# EAGLE board D21_v38 (EAGLE 7.3.0)
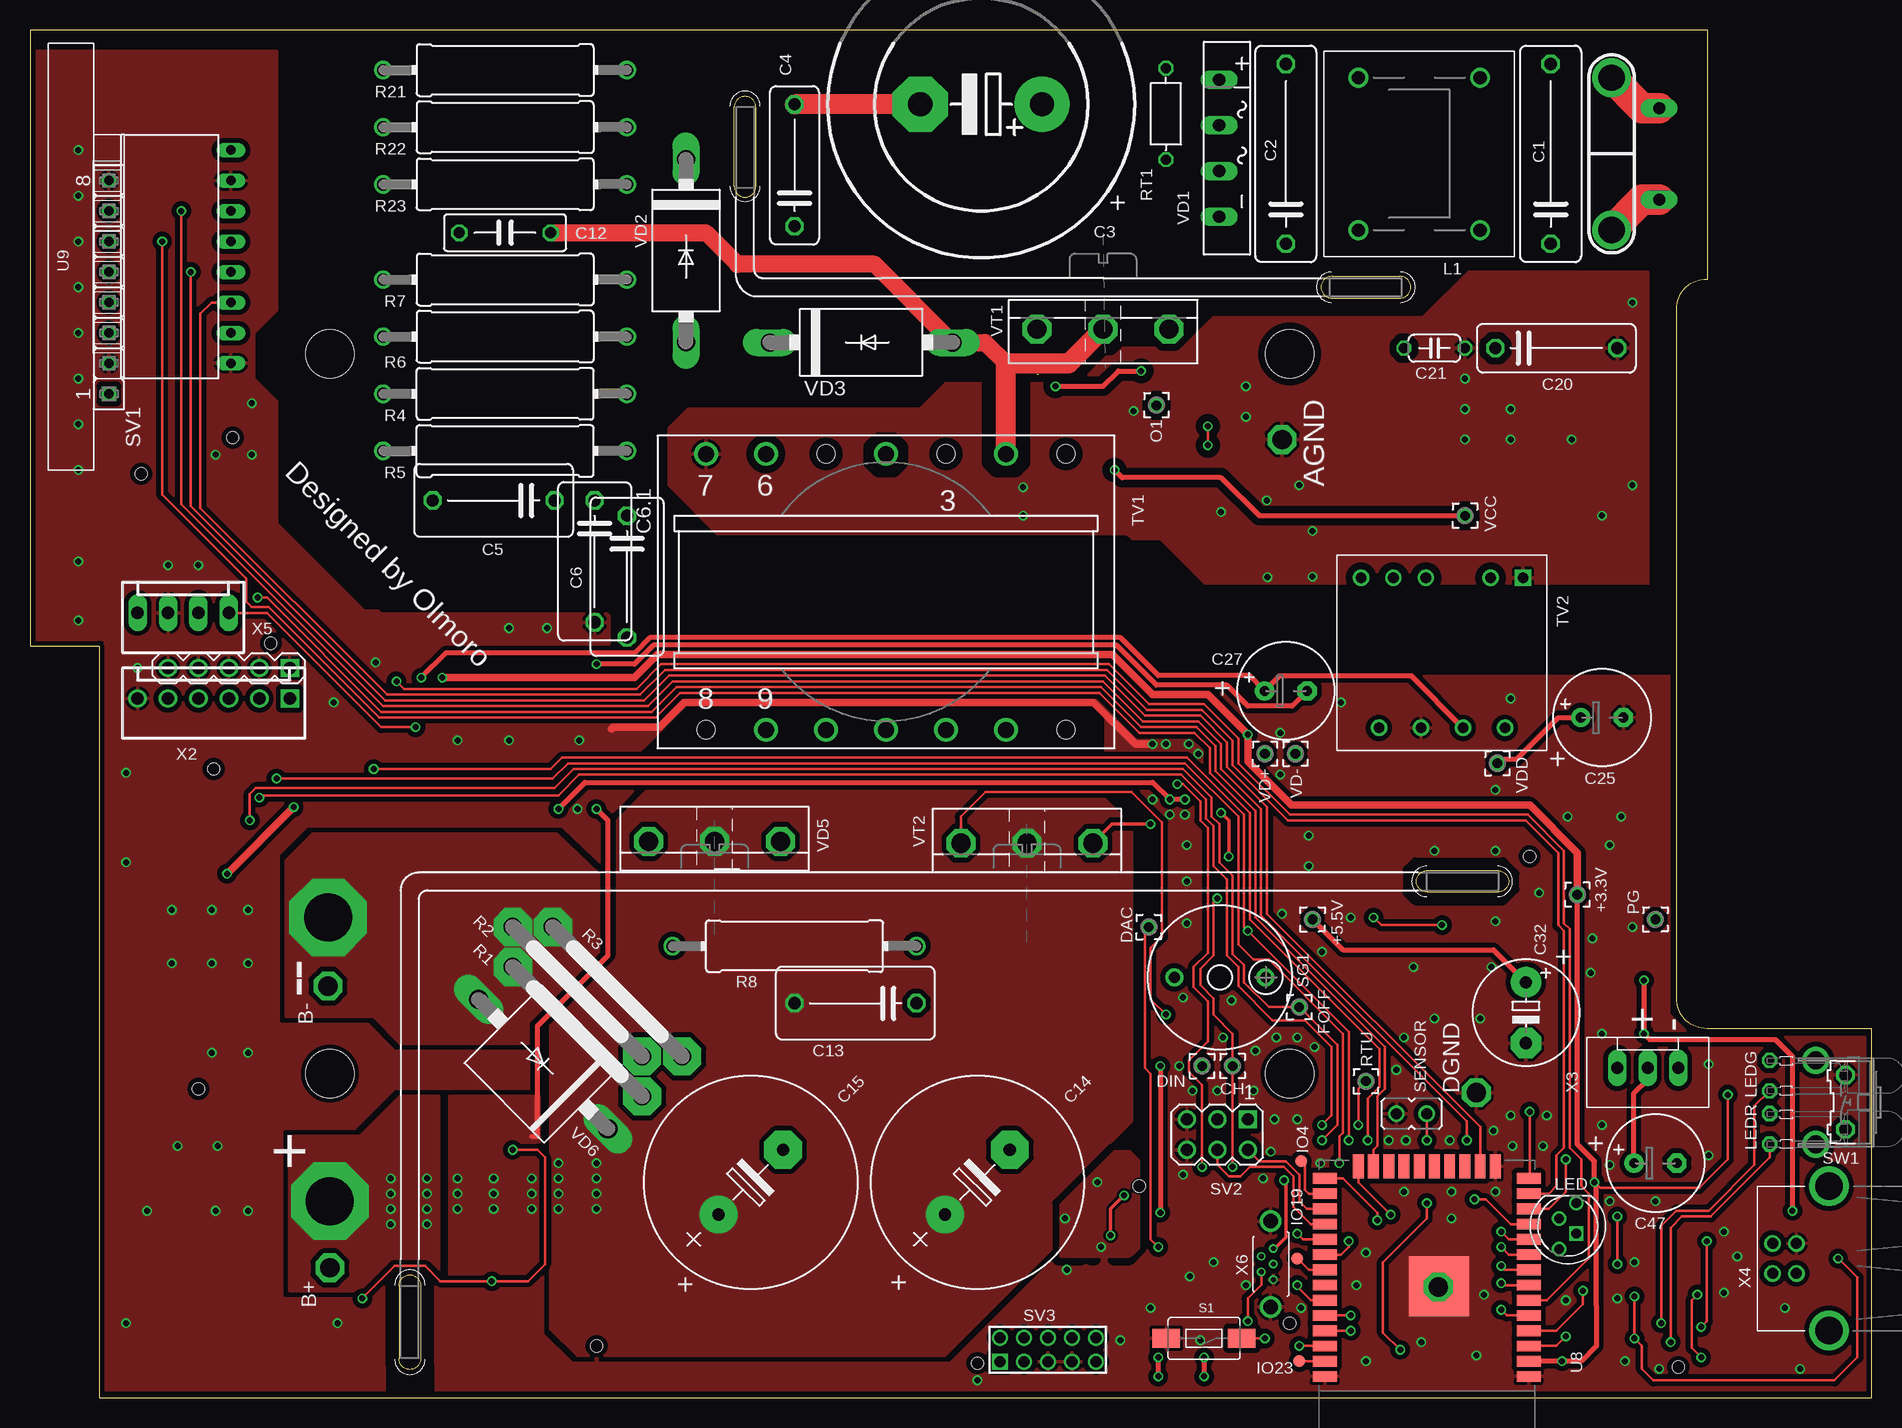
[diagram p4: board, top side]
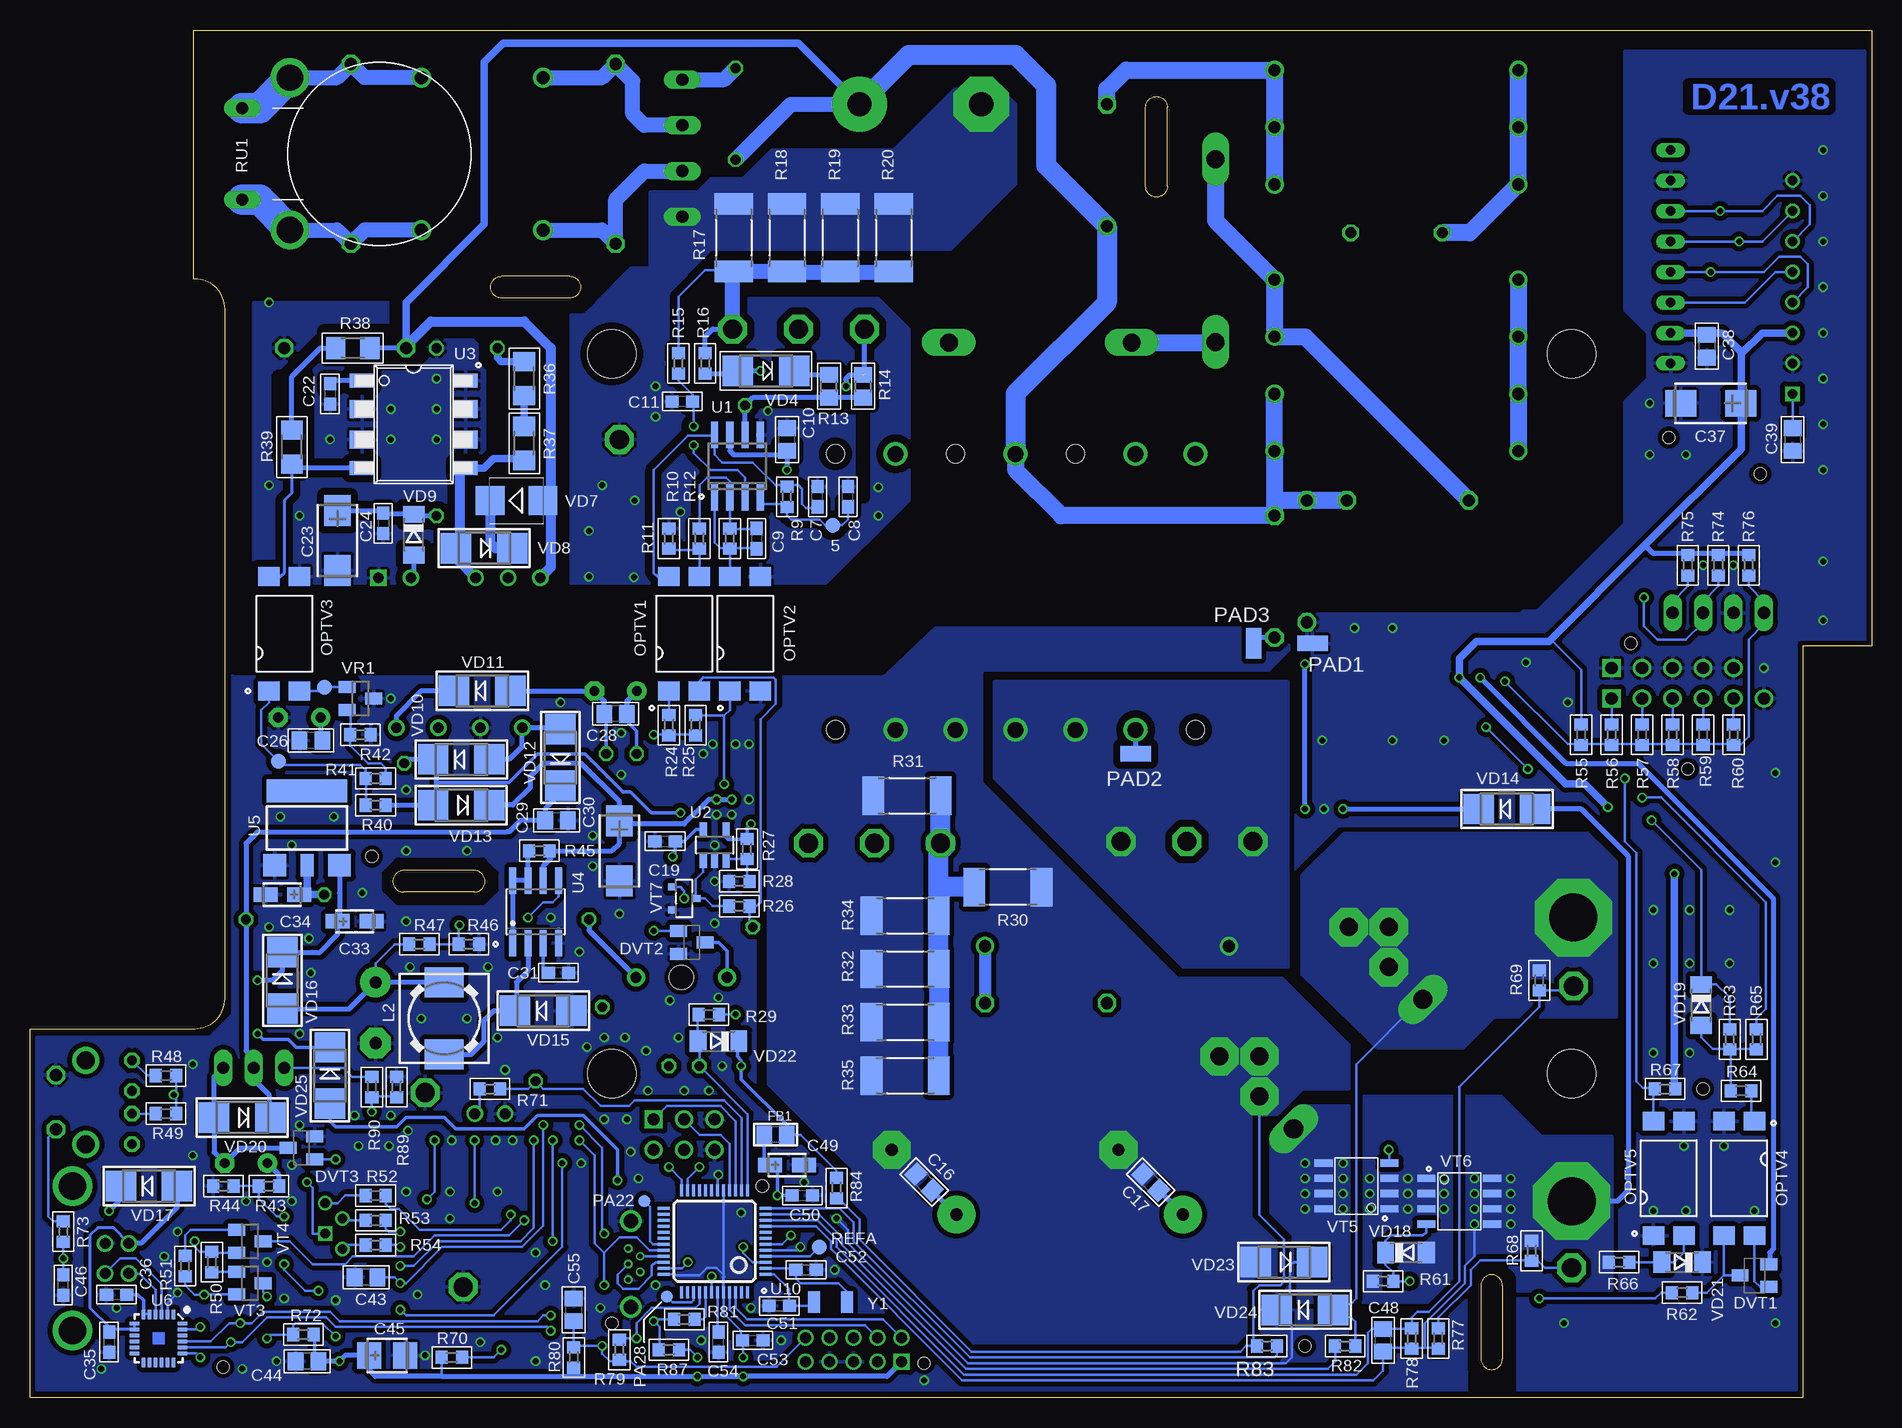
[diagram p5: board, bottom side, seen from below]

Size 153.5 x 114 mm. Coordinates in mm from the lower left corner, seen from the top.
Outline: 5.75,0 153.5,0 153.5,30.75 139.75,30.75 arc-90 137.25,33.25 137.25,90.75 arc-90 139.75,93.25 139.85,93.25 139.85,114 0,114 0,62.66 5.75,62.66 5.75,0
Copper layers (1*16): Top 0.018mm / dielectric 1.5mm / Bottom 0.018mm
Design rules "4-layers_00_2016 *": minimum track width 0.2mm, minimum drill 0.4mm, track to track 0.2mm, track to pad 0.2mm, pad to pad 0.2mm, via to via 0.2mm, smd to smd 0.2mm, copper to edge 0.2mm, drill to drill 0.4mm, minimum pad ring 0.15mm, minimum via ring 0.15mm, stop-mask expansion 4mil, vias tented up to drill 0mil, thermal gap 10mil
Holes 4 mm at 105,27 25,27 25,87 105,87
Holes 2 mm at 99.21,35.01
Holes 1 mm at 105,6.2 92.46,17.63 125.01,45.09 137.39,2.55 78.97,2.87 47.22,4.3 14.04,25.73 15.31,52.4 20.07,62.87 9.28,77 16.9,80.02
tRestrict: 82 lines
bRestrict: 89 lines
vRestrict: area 102,24 to 108,30; area 102,84 to 108,90; area 22,24 to 28,30; area 22,84 to 28,90

## Footprints (pad centres in the part's own frame; a part is rotated, then mirrored left to right if it is on the bottom)
B1,27 = smd 1.27 x 1.27: TP 0,0
MA05-1 = drill 1.016 square: 1 -5.08,0 | drill 1.016: 2 -2.54,0; 3 0,0; 4 2.54,0; 5 5.08,0
WIREPAD8_3 = drill 4 pad 6.452 octagon: P$1 0,0
1,6/0,8 = drill 0.8 octagon: 1 0,0
4,16O1,6 = drill 1.6 octagon: 1 0,0
C150-054X183 = drill 1.016 octagon: 1 -7.493,0; 2 7.493,0
EB25D = drill 2.007 pad 4.597: + -5.08,0 | drill 2.007 pad 4.597 octagon: - 5.08,0
C102-043X133 = drill 1.016 octagon: 1 -5.08,0; 2 5.08,0
C102-064X133 = drill 1.016 octagon: 1 -5.08,0; 2 5.08,0
C0603 = smd 1.1 x 1: 1 -0.85,0; 2 0.85,0
C0805 = smd 1.3 x 1.5: 1 -0.95,0; 2 0.95,0
C075-032X103 = drill 0.914 octagon: 1 -3.81,0; 2 3.81,0
E7,5-18 = drill 1.016 pad 3.15: + -3.81,0 | drill 1.016 pad 3.15 octagon: - 3.81,0
C050-024X044 = drill 0.813 octagon: 1 -2.54,0; 2 2.54,0
CT6032 = smd 2.6 x 2.2: + 2.5,0; - -2.5,0
E3,5-8 = drill 0.813 pad 1.6: + -1.778,0 | drill 0.813 pad 1.6 octagon: - 1.778,0
E5-8,5 = drill 1.016 pad 2.54: + -2.54,0 | drill 1.016 pad 2.54 octagon: - 2.54,0
CT3216 = smd 2 x 1.2: + 1.4,0; - -1.4,0
CT3528 = smd 2 x 2.2: + 1.5,0; - -1.5,0
SC59-BEC = smd 1 x 1.4: B -0.95,-1.2; C 0,1.2; E 0.95,-1.2
SOT23-BEC = smd 1 x 1.4: B -0.95,-1.1; C 0,1.1; E 0.95,-1.1
0805 = smd 1.3 x 1.5: 1 -0.95,0; 2 0.95,0
TESTPOINT_ROUND_1MM = smd 1 x 1: P$1 0,0
DK30 = drill 1.1: 1 -6.35,-5.08; 2 -6.35,5.08; 3 6.35,-5.08; 4 6.35,5.08
DR74 = smd 2.5 x 3.25: 1 -3,0; 2 3,0
LED5MMRGB = drill 0.8: P$1 -1.905,0.714; P$2 -0.635,-0.714; P$4 1.905,-0.714 | drill 0.8 square: P$3 0.635,0.714
LED3MM-H7MMG = drill 0.813 pad 1.27 octagon: A 0,-1.27; K 0,1.27
LED3MM-H7MMR = drill 0.813 pad 1.27 octagon: A 0,-1.27; K 0,1.27
SMD4-7 = smd 1.78 x 1.55: 1 -1.27,-4.77; 2 1.27,-4.77; 3 1.27,4.77; 4 -1.27,4.77
SMD1,27-2,54 = smd 1.27 x 2.54: 1 0,0
15S-1.3 = drill 1.5 pad 3.2 octagon: 1 -7.62,0; 2 7.62,0
0515/20 = drill 1.016: 1 -10.16,0; 2 10.16,0
R0603 = smd 1 x 1.1: 1 -0.85,0; 2 0.85,0
R0805 = smd 1.3 x 1.5: 1 -0.95,0; 2 0.95,0
R2512 = smd 1.8 x 3.2: 1 -2.8,0; 2 2.8,0
R1206 = smd 1.6 x 1.803: 1 -1.422,0; 2 1.422,0
NTC15 = drill 0.813 octagon: 1 -3.81,0; 2 3.81,0
S10K11-H = drill 1.016 long: 1 0,-3.81; 2 0,3.81
TACTILE-SWITCH-1101NE = smd 2.3 x 1.6: P$1 -3.15,0; P$2 3.15,0
JP1 = drill 0.914: 1 0,-1.27; 2 0,1.27
BMT1205XH7.5 = drill 0.9 pad 1.5: + 3.8,0; - -3.8,0
FE08 = drill 0.813 square: 1 -8.89,0 | drill 0.813: 2 -6.35,0; 3 -3.81,0; 4 -1.27,0; 5 1.27,0; 6 3.81,0; 7 6.35,0; 8 8.89,0
MA03-2 = drill 1.016 square: 1 -2.54,-1.27 | drill 1.016: 2 -2.54,1.27; 3 0,-1.27; 4 0,1.27; 5 2.54,-1.27; 6 2.54,1.27
MA5-2-2MM = drill 0.9 pad 1.27 square: 1 -4,-1 | drill 0.9 pad 1.27: 2 -4,1; 3 -2,-1; 4 -2,1; 5 0,-1; 6 0,1; 7 2,-1; 8 2,1; 9 4,-1; 10 4,1
B3F-31XX = drill 1.016 octagon: 1 -2.261,-1.245; 2 2.261,-1.245 | drill 1.499 pad 2.159: 3 -3.505,1.245; 4 3.505,1.245
BS25022 = drill 1.321: 2 -10,-11.5; 4 0,-11.5; 6 10,-11.5; 7 15,-11.5; 9 10,11.5; 10 5,11.5; 11 0,11.5; 12 -5,11.5; 13 -10,11.5 | hole 1.5: -15,-11.5; -5,-11.5; 5,-11.5; 15,11.5; -15,11.5
BS9001 = drill 0.9 square: 1 -6.25,6.75 | drill 0.9: 2 -6.25,4.05; 4 -6.25,-1.35; 5 -6.25,-4.05; 6 -6.25,-6.75; 7 6.25,-5.25; 8 6.25,-1.75; 9 6.25,1.75; 10 6.25,5.25
SO08 = smd 0.6 x 2.2: 1 -1.905,-2.6; 2 -0.635,-2.6; 3 0.635,-2.6; 4 1.905,-2.6; 5 1.905,2.6; 6 0.635,2.6; 7 -0.635,2.6; 8 -1.905,2.6
SOT23-5 = smd 0.6 x 1.2: 1 -0.95,-1.306; 2 0,-1.306; 3 0.95,-1.306; 4 0.95,1.306; 5 -0.95,1.306
SMD-8 = smd 1.168 x 2.032: 1 -3.632,-4.318; 4 3.632,-4.318; 5 3.632,4.318; 8 -3.632,4.318 | smd 1.524 x 2.032: 2 -1.27,-4.318; 3 1.27,-4.318; 6 1.27,4.318; 7 -1.27,4.318
SOT223-W = smd 1.9 x 1.9: 1 -2.7,-3.1; 3 2.7,-3.1 | smd 1.1 x 1.9: 2 0,-3.1 | smd 6.7 x 1.9: 4 0,3.1
QFN-24 = smd 0.8 x 0.3: 1 -2,1.25; 2 -2,0.75; 3 -2,0.25; 4 -2,-0.25; 5 -2,-0.75; 6 -2,-1.25; 13 2,-1.25; 14 2,-0.75; 15 2,-0.25; 16 2,0.25; 17 2,0.75; 18 2,1.25 | smd 0.3 x 0.8: 7 -1.25,-2; 8 -0.75,-2; 9 -0.25,-2; 10 0.25,-2; 11 0.75,-2; 12 1.25,-2; 19 1.25,2; 20 0.75,2; 21 0.25,2; 22 -0.25,2; 23 -0.75,2; 24 -1.25,2
ESP-WROOM-32MORO = smd 2 x 0.9: 1 -8.5,8.255; 2 -8.5,6.985; 3 -8.5,5.715; 4 -8.5,4.445; 5 -8.5,3.175; 6 -8.5,1.905; 7 -8.5,0.635; 8 -8.5,-0.635; 9 -8.5,-1.905; 10 -8.5,-3.175; 11 -8.5,-4.445; 12 -8.5,-5.715; 13 -8.5,-6.985; 14 -8.5,-8.255; 25 8.5,-8.255; 26 8.5,-6.985; 27 8.5,-5.715; 28 8.5,-4.445; 29 8.5,-3.175; 30 8.5,-1.905; 31 8.5,-0.635; 32 8.5,0.635; 33 8.5,1.905; 34 8.5,3.175; 35 8.5,4.445; 36 8.5,5.715; 37 8.5,6.985; 38 8.5,8.255 | smd 0.9 x 2: 15 -5.715,-9.255; 16 -4.445,-9.255; 17 -3.175,-9.255; 18 -1.905,-9.255; 19 -0.635,-9.255; 20 0.635,-9.255; 21 1.905,-9.255; 22 3.175,-9.255; 23 4.445,-9.255; 24 5.715,-9.255 | smd 5 x 5: 39 -1,0.75
TFT_1_8 = drill 0.813 long: 1 -8.89,-11.43; 2 -6.35,-11.43; 3 -3.81,-11.43; 4 -1.27,-11.43; 5 1.27,-11.43; 6 3.81,-11.43; 7 6.35,-11.43; 8 8.89,-11.43
LQFP48_W = smd 0.27 x 1: 1 -2.75,-4.25; 2 -2.25,-4.25; 3 -1.75,-4.25; 4 -1.25,-4.25; 5 -0.75,-4.25; 6 -0.25,-4.25; 7 0.25,-4.25; 8 0.75,-4.25; 9 1.25,-4.25; 10 1.75,-4.25; 11 2.25,-4.25; 12 2.75,-4.25; 25 2.75,4.25; 26 2.25,4.25; 27 1.75,4.25; 28 1.25,4.25; 29 0.75,4.25; 30 0.25,4.25; 31 -0.25,4.25; 32 -0.75,4.25; 33 -1.25,4.25; 34 -1.75,4.25; 35 -2.25,4.25; 36 -2.75,4.25 | smd 1 x 0.27: 13 4.25,-2.75; 14 4.25,-2.25; 15 4.25,-1.75; 16 4.25,-1.25; 17 4.25,-0.75; 18 4.25,-0.25; 19 4.25,0.25; 20 4.25,0.75; 21 4.25,1.25; 22 4.25,1.75; 23 4.25,2.25; 24 4.25,2.75; 37 -4.25,2.75; 38 -4.25,2.25; 39 -4.25,1.75; 40 -4.25,1.25; 41 -4.25,0.75; 42 -4.25,0.25; 43 -4.25,-0.25; 44 -4.25,-0.75; 45 -4.25,-1.25; 46 -4.25,-1.75; 47 -4.25,-2.25; 48 -4.25,-2.75
2KBP = drill 1.016 long: + 5.715,0; - -5.715,0; AC1 -1.905,0; AC2 1.905,0
DO201-15 = drill 1.499 long: A 7.62,0; C -7.62,0
SMADIODE = smd 2.54 x 2.54: A 2.349,0; C -2.349,0
TO-247AD-V = drill 1.6 octagon: D 0,-2.54; G -5.5,-2.54; S 5.5,-2.54
P6-15 = drill 1.6 long: A 7.62,0; C -7.62,0
SMB = smd 2.4 x 2.4: A 2.2,0; C -2.2,0
SOD80C = smd 1.4 x 1.8: A 1.7,0; C -1.7,0
SOT23 = smd 1 x 1.4: 1 -0.95,-1.1; 2 0.95,-1.1; 3 0,1.1
SO-8 = smd 1.524 x 0.61: 1 -2.743,1.905; 2 -2.743,0.635; 3 -2.743,-0.635; 4 -2.743,-1.905; 5 2.743,-1.905; 6 2.743,-0.635; 7 2.743,0.635; 8 2.743,1.905
SOT23-R = smd 0.6 x 0.7: 1 -0.95,-1; 2 0.95,-1; 3 0,1
220VAC = drill 2.2: P$1 -6.35,0; P$2 6.35,0
WF-6 = drill 1.016 square: 1 0,-6.35 | drill 1.016: 2 0,-3.81; 3 0,-1.27; 4 0,1.27; 5 0,3.81; 6 0,6.35
WF-3 = drill 1.016 long: 1 0,-2.54; 2 0,0; 3 0,2.54
USB-B-H = drill 0.914: D+ 0,1.25; D- 1.981,1.25; GND 0,-1.25; VBUS 1.981,-1.25 | drill 2.286: P$1 -2.718,-6.02; P$2 -2.718,6.02
WF-4 = drill 1.016 long: 1 0,-3.81; 2 0,-1.27; 3 0,1.27; 4 0,3.81
USB_MICRO_180 = drill 0.4 pad 0.7: 1 -1.302,0.218; 2 -0.652,-0.782; 3 -0.002,0.218; 4 0.648,-0.782; 5 1.298,0.218 | drill 1.2: 6 -3.577,-0.002; 7 3.573,-0.002
SMD03215C2 = smd 1 x 1.8: P$1 -1.5,0; P$2 1.25,0

## Placement (x,y rotation side)
5  TPB1,27  [B1,27]  86.59,72.72 0 bottom
(X2)  [MA05-1]  16.58,60.81 180 top
+  +  [WIREPAD8_3]  24.99,16.36 0 top
+3.3V  [1,6/0,8]  128.98,41.92 0 top
+5.5V  [1,6/0,8]  106.91,39.86 180 top
-  -  [WIREPAD8_3]  24.84,40.01 0 top
AGND  [4,16O1,6]  104.37,79.86 270 top
B+  [4,16O1,6]  24.99,10.8 90 top
B-  [4,16O1,6]  24.84,34.3 270 top
C1  473K 275V  [C150-054X183]  126.75,103.67 90 top
C2  473K 275V  [C150-054X183]  104.69,103.67 90 top
C3  220mkF 400V  [EB25D]  79.29,107.8 180 top
C4  10nF 2KV  [C102-043X133]  63.73,102.72 90 top
C5  4.7nF ± 10% 2KV  [C102-064X133]  38.65,74.78 180 top
C6  JEC JY222M  [C102-064X133]  49.76,68.43 270 top
C6.1  JEC JY222M  [C102-064X133]  47.06,69.7 270 top
C7  100nF X7R  [C0603]  87.86,75.1 90 bottom
C8  1nF NP0  [C0603]  85.32,75.1 90 bottom
C9  100nF X7R  [C0603]  92.94,71.61 270 bottom
C10  100nF X7R  [C0805]  90.4,79.86 90 bottom
C11  470pF X7R  [C0603]  99.13,83.03 180 bottom
C12  0.15nF 2kV  [C075-032X103]  39.6,97.09 180 top
C13  4.7nF 1KV  [C102-064X133]  68.81,32.87 180 top
C14  4700mkF 35V  [E7,5-18]  78.97,17.95 45 top
C15  4700mkF 35V  [E7,5-18]  60.08,17.95 45 top
C16  1mkF X7R 50V  [C0805]  78.97,17.95 135 bottom
C17  1mkF X7R 50V  [C0805]  60.08,17.95 135 bottom
C19  100nF X7R  [C0603]  100.56,46.36 0 bottom
C20  10nF 2KV  [C102-043X133]  127.23,87.48 0 top
C21  68pF 2KV (82pF)  [C050-024X044]  117.07,87.48 0 top
C22  100nF X7R  [C0603]  128.5,83.67 270 bottom
C23  TAJB106K025RNJ  [CT6032]  127.87,71.45 90 bottom
C24  100nF X7R  [C0603]  124.06,72.88 270 bottom
C25  220uF 35v  [E3,5-8]  131.04,56.68 0 top
C26  470nF X7R  [C0805]  130.09,54.78 180 bottom
C27  220uF 35v  [E3,5-8]  104.69,58.91 0 top
C28  100nF X7R  [C0805]  104.69,57 180 bottom
C29  1mkF X7R  [C0805]  109.61,48.11 0 bottom
C30  T491A106K035AT  [CT6032]  104.37,45.57 90 bottom
C31  470pF X7R  [C0603]  109.45,35.41 0 bottom
C32  470uF 16v  [E5-8,5]  124.69,32.08 270 top
C33  T491A106K010AT  [CT3216]  126.44,39.7 180 bottom
C34  T491A106K010AT  [CT3216]  132.47,41.92 0 bottom
C35  100nF X7R  [C0603]  146.92,4.61 270 bottom
C36  100nF X7R  [C0603]  146.28,8.58 180 bottom
C37  TAJB336K010RNJ  [CT6032]  13.41,82.88 0 bottom
C38  470nF X7R  [C0805]  13.72,87.64 270 bottom
C39  470nF X7R  [C0805]  6.58,79.86 270 bottom
C43  470nF X7R  [C0805]  125.48,10.01 180 bottom
C44  1mkF X7R  [C0805]  130.41,3.02 180 bottom
C45  TAJC107K006RNJ  [CT3528]  123.74,3.5 180 bottom
C46  3.3uF X7R  [C0603]  150.72,9.38 90 bottom
C47  470mkF 25v  [E3,5-8]  135.49,19.53 0 top
C48  470nF X7R  [C0805]  40.71,4.77 90 bottom
C49  T491A106K010AT  [CT3216]  90.4,19.38 180 bottom
C50  100nF X7R  [C0603]  89.13,16.84 0 bottom
C51  15pF X7R  [C0603]  91.03,7.63 180 bottom
C52  15pF X7R  [C0603]  88.81,10.65 0 bottom
C53  100nF X7R  [C0603]  93.26,4.77 0 bottom
C54  100nF X7R  [C0603]  96.11,4.61 90 bottom
C55  100nF X7R  [C0805]  108.18,7.31 270 bottom
CH  [1,6/0,8]  100.24,27.63 0 top
DAC  [1,6/0,8]  93.26,39.22 90 top
DGND  [4,16O1,6]  120.56,25.41 270 top
DGND1  [4,16O1,6]  117.39,9.22 0 top
DIN  [1,6/0,8]  97.7,27.63 180 top
DVT1  PDTA123ET  [SC59-BEC]  9.76,10.17 90 bottom
DVT2  PDTD123ET  [SOT23-BEC]  98.34,37.95 270 bottom
DVT3  PDTD123ET  [SOT23-BEC]  130.88,20.8 90 bottom
FB1  BLM21AG221SN1D  [0805]  91.35,21.92 180 bottom
FOFF  [1,6/0,8]  105.8,32.55 90 top
HS1  HS92X40-2  [YS92X40]  31.66,43.03 180 top
HS2  HS55X15-1  [HS55X15]  59.6,92.56 0 top
IO4  [TESTPOINT_ROUND_1MM]  105.96,19.69 90 top
IO19  [TESTPOINT_ROUND_1MM]  105.64,11.6 90 top
IO23  [TESTPOINT_ROUND_1MM]  105.8,3.02 90 top
L1  PLA10AN1522R0R2  [DK30]  115.8,103.67 90 top
L2  SD74R-221  [DR74]  118.97,31.6 270 bottom
LED  5mm RGB LED common anode  [LED5MMRGB]  128.18,14.3 270 top
LEDG  LED3MM-GREEN  [LED3MM-H7MMG]  145.01,26.84 180 top
LEDR  LED3MM-RED  [LED3MM-H7MMR]  145.01,22.39 180 top
O1  [1,6/0,8]  93.89,82.72 0 top
OPTV1  K10104C  [SMD4-7]  98.97,63.67 0 bottom
OPTV2  K10104C  [SMD4-7]  93.89,63.67 0 bottom
OPTV3  K10104C  [SMD4-7]  132.31,63.67 0 bottom
OPTV4  K10104C  [SMD4-7]  11.02,18.27 180 bottom
OPTV5  K10104C  [SMD4-7]  16.9,18.27 0 bottom
PA22  [TESTPOINT_ROUND_1MM]  102.31,16.36 0 bottom
PA28  [TESTPOINT_ROUND_1MM]  100.4,8.42 0 bottom
PAD1  [SMD1,27-2,54]  46.59,62.87 90 bottom
PAD2  [SMD1,27-2,54]  61.35,53.67 270 bottom
PAD3  [SMD1,27-2,54]  51.51,62.87 0 bottom
PG  [1,6/0,8]  135.49,39.86 90 top
R1  15S-1.3  [15S-1.3]  45.63,30.49 135 top
R2  15S-1.3  [15S-1.3]  45.63,33.82 135 top
R3  15S-1.3  [15S-1.3]  48.97,33.82 135 top
R4  12k ± 5%  [0515/20]  39.6,83.67 0 top
R5  12k ± 5%  [0515/20]  39.6,78.91 0 top
R6  12k ± 5%  [0515/20]  39.6,88.43 180 top
R7  12k ± 5%  [0515/20]  39.6,93.19 180 top
R8  39 Om ± 5%  [0515/20]  63.73,37.63 0 top
R9  9k1 1%  [R0603]  90.4,75.1 270 bottom
R10  10k  [R0603]  97.7,71.61 90 bottom
R11  2k2  [R0603]  100.24,71.61 270 bottom
R12  10k  [R0603]  95.16,71.61 90 bottom
R13  1R0  [R0805]  86.91,84.31 90 bottom
R14  5R1  [R0805]  84.05,84.31 90 bottom
R15  1k  [R0603]  99.45,86.21 90 bottom
R16  10k  [R0603]  97.23,86.21 270 bottom
R17  1R0 1%  [R2512]  94.84,96.69 270 bottom
R18  1R0 1%  [R2512]  90.4,96.69 270 bottom
R19  1R0 1%  [R2512]  85.95,96.69 270 bottom
R20  1R0 1%  [R2512]  81.51,96.69 270 bottom
R21  1.2k ± 5%  [0515/20]  39.6,110.66 180 top
R22  1.2k ± 5%  [0515/20]  39.6,105.9 180 top
R23  1.2k ± 5%  [0515/20]  39.6,101.13 180 top
R24  470  [R0603]  100.24,56.05 270 bottom
R25  470  [R0603]  98.02,56.05 270 bottom
R26  5k1  [R0603]  94.37,40.97 0 bottom
R27  [R0603]  93.73,45.73 270 bottom
R28  [R0603]  94.37,43.03 180 bottom
R29  [R0603]  96.91,31.92 180 bottom
R30  1R0 1%  [R2512]  71.98,42.55 180 bottom
R31  1R0 1%  [R2512]  80.4,50.17 0 bottom
R32  1R0 1%  [R2512]  80.56,35.73 0 bottom
R33  1R0 1%  [R2512]  80.56,31.28 0 bottom
R34  1R0 1%  [R2512]  80.56,40.17 0 bottom
R35  1R0 1%  [R2512]  80.56,26.84 0 bottom
R36  k75  [R1206]  112.31,84.94 270 bottom
R37  k75  [R1206]  112.31,79.54 270 bottom
R38  1MOm  [R1206]  126.59,87.48 180 bottom
R39  1MOm  [R1206]  131.68,79.22 270 bottom
R40  100  [R0603]  124.69,49.38 180 bottom
R41  10k0 1%  [R0603]  124.69,51.6 0 bottom
R42  1k5 1%  [R0603]  125.96,55.25 0 bottom
R43  5k1 1%  [R0603]  133.58,17.63 180 bottom
R44  1k 1%  [R0603]  137.39,17.63 0 bottom
R45  0R33  [R0603]  111.04,45.57 180 bottom
R46  3.0k 1%  [R0603]  116.91,37.79 180 bottom
R47  10k 1%  [R0603]  121.04,37.79 180 bottom
R48  1K  [R0603]  142.15,26.84 0 bottom
R49  1K  [R0603]  142.15,23.66 0 bottom
R50  12K  [R0603]  138.34,11.28 90 bottom
R51  12K  [R0603]  140.56,10.96 270 bottom
R52  150R  [R0603]  124.69,16.84 180 bottom
R53  330R  [R0603]  124.69,14.77 180 bottom
R54  470R  [R0603]  124.69,12.71 180 bottom
R55  1.5k 1%  [R0603]  24.2,55.25 90 bottom
R56  k750 1%  [R0603]  21.66,55.25 90 bottom
R57  k300 1%  [R0603]  19.12,55.25 270 bottom
R58  1k5 1%  [R0603]  16.58,55.25 270 bottom
R59  3k0 1%  [R0603]  14.04,55.25 270 bottom
R60  7k5 1%  [R0603]  11.5,55.25 90 bottom
R61  2.2k  [R0603]  40.71,9.69 180 bottom
R62  330  [R0603]  15.79,8.74 0 bottom
R63  nu  [R0603]  11.82,29.85 270 bottom
R64  330  [R0603]  10.87,25.57 0 bottom
R65  330  [R0603]  9.6,29.85 270 bottom
R66  2.2k  [R0603]  21.03,11.28 0 bottom
R67  68k  [R0603]  17.22,25.73 180 bottom
R68  100R  [R0603]  28.33,12.23 90 bottom
R69  100R  [R0603]  27.69,34.77 90 bottom
R70  10k 1%  [R0603]  118.34,3.34 0 bottom
R71  30k  [R0603]  115.16,25.73 0 bottom
R72  12k  [R0603]  130.72,5.25 180 bottom
R73  470  [R0603]  150.72,13.82 90 bottom
R74  4k7  [R0603]  12.77,69.38 270 bottom
R75  4k7  [R0603]  15.31,69.38 270 bottom
R76  4k7  [R0603]  10.23,69.38 270 bottom
R77  39k0 1%  [R0603]  36.11,4.93 90 bottom
R78  7k5 1%  [R0603]  38.33,4.93 90 bottom
R79  470  [R0603]  104.37,3.98 270 bottom
R80  10k  [R0603]  108.18,3.34 270 bottom
R81  470??  [R0603]  98.97,6.52 180 bottom
R82  100  [R0603]  43.89,4.3 0 bottom
R83  100  [R0603]  50.39,4.3 180 bottom
R84  10k  [R0603]  86.27,17.47 90 bottom
R87  470??  [R0603]  100.24,3.98 180 bottom
R89  [R0603]  122.94,25.89 90 bottom
R90  [R0603]  125.01,25.89 270 bottom
REFA  TPB1,27  [B1,27]  87.7,12.55 0 bottom
RT1  NTC10D-15  [NTC15]  94.69,107.01 90 top
RTU  [1,6/0,8]  111.35,26.36 90 top
RU1  V275LA20AP  [S10K11-H]  135.8,103.67 0 bottom
S1  FSMSM  [TACTILE-SWITCH-1101NE]  97.86,4.93 180 top
SENSOR  [JP1]  115.16,23.66 270 top
SG1  BMT1205XH7.5  [BMT1205XH7.5]  99.2,35.03 0 top
SV1  [FE08]  6.58,92.56 90 top
SV2  [MA03-2]  98.97,21.92 180 top
SV3  MA05-2-2MM  [MA5-2-2MM]  84.84,3.98 0 top
SW1  SWT-3  [B3F-31XX]  150.09,24.62 90 top
TP11  TPB1,27  [B1,27]  132.79,53.03 180 bottom
TP12  TPB1,27  [B1,27]  128.98,59.22 180 bottom
TV1  BS25022  [BS25022]  71.35,67.16 180 top
TV2  BS9001  [BS9001]  117.7,62.08 270 top
U0  D20BOX  [D20BOX]  65,57 90 top
U1  UC3845B  [SO08]  94.53,77.64 0 bottom
U2  LM321MF  [SOT23-5]  96.43,46.05 0 bottom
U3  TNY254GN  [SMD-8]  121.52,81.13 270 bottom
U4  MC34063AD  [SO08]  111.35,40.49 0 bottom
U5  LM1117MP-3.3  [SOT223-W]  130.41,47.48 0 bottom
U6  CP2104  [QFN-24]  142.79,4.93 270 bottom
U8  ESP-WROOM-32 MODULE  [ESP-WROOM-32MORO]  116.44,10.01 180 top
U9  WF18FTLAADNN0  [TFT_1_8]  5.31,95.1 90 top
U10  ATSAMD21G1XA-A  [LQFP48_W]  96.43,13.03 90 bottom
VCC  [1,6/0,8]  119.61,73.51 0 top
VD1  KBP206  [2KBP]  99.13,104.15 90 top
VD2  SF58  [DO201-15]  54.68,95.61 270 top
VD3  SF58  [DO201-15]  69.29,87.96 0 top
VD4  US1M  [SMADIODE]  92.15,85.58 180 bottom
VD5  MBR30100PT  [TO-247AD-V]  57.06,43.82 180 top
VD6  FR607  [P6-15]  42.77,27.79 135 top
VD7  P6SMB200A  [SMB]  112.94,74.78 0 bottom
VD8  US1M  [SMADIODE]  115.64,70.81 180 bottom
VD9  LL4148  [SOD80C]  121.52,71.92 270 bottom
VD10  US1M  [SMADIODE]  117.55,53.19 0 bottom
VD11  US1M  [SMADIODE]  115.8,58.91 0 bottom
VD12  US1M  [SMADIODE]  109.29,53.35 90 bottom
VD13  US1M  [SMADIODE]  117.55,49.38 180 bottom
VD14  SS16  [SMADIODE]  30.39,49.06 0 bottom
VD15  SS16  [SMADIODE]  110.72,32.23 0 bottom
VD16  SS16  [SMADIODE]  132.47,34.77 270 bottom
VD17  SS16  [SMADIODE]  143.58,17.63 0 bottom
VD18  BZV55C13  [SOD80C]  38.81,12.07 0 bottom
VD19  LL4148 nu  [SOD80C]  14.2,32.71 270 bottom
VD20  US1M  [SMADIODE]  135.8,23.34 180 bottom
VD21  LL4148  [SOD80C]  15.79,11.28 180 bottom
VD22  LL4148 nu  [SOD80C]  96.11,29.7 180 bottom
VD23  SS16  [SMADIODE]  48.97,11.28 180 bottom
VD24  SS16  [SMADIODE]  47.22,7.31 0 bottom
VD25  SS16  [SMADIODE]  128.5,26.84 270 bottom
VD+  [1,6/0,8]  102.94,53.67 90 top
VD-  [1,6/0,8]  105.48,53.67 90 top
VDD  [1,6/0,8]  122.31,52.87 90 top
VR1  TL431A (TAI 3)  [SOT23]  125.96,58.27 270 bottom
VT1  STW10NK60Z  [TO-247AD-V]  89.45,91.61 0 top
VT2  IRFP250N  [TO-247AD-V]  83.1,43.66 180 top
VT3  BC847C  [SOT23]  135.17,9.53 270 bottom
VT4  BC847C  [SOT23]  135.17,13.03 270 bottom
VT5  IRF8788  [SO-8]  42.93,17.63 180 bottom
VT6  IRF8788  [SO-8]  34.36,16.36 0 bottom
VT7  2N7002  [SOT23-R]  98.97,41.6 270 bottom
X1  220VAC  [220VAC]  131.83,103.67 90 top
X2  WF-6 (PLD-10)  [WF-6]  15.31,58.27 90 top
X3  WF-3 (WF-2)  [WF-3]  134.85,27.47 90 top
X4  USB-B  [USB-B-H]  147.23,11.6 180 top
X5  WF-4  [WF-4]  12.77,65.41 90 top
X6  USB_MICRO_BF_180  [USB_MICRO_180]  103.42,11.12 270 top
Y1  FC-135  [SMD03215C2]  86.91,7.95 180 bottom

## Tracks (layer width: path | path; a pad name or v marks a point on that pad's centre or on a via)
5.5V
  Top 0.4: +5.5V.1 109.45,37.31 121.99,37.31 C32.+
  Bottom 0.2: R47.2 123.1,37.79 124.69,36.2 C32.+
  Bottom 0.4: VD16.A 132.44,32.39 126.91,32.39 C32.+ 124.67,34.6 119.77,34.6 | 119.83,34.66 119.77,34.6 | 119.77,34.6 L2.1
  Bottom 0.406: +5.5V.1 106.91,38.94 SG1.+
10-11
  pour Bottom (isolate 0.61, no thermals): 48.65,35.89 57.38,35.89 73.1,51.6 73.1,59.7 48.65,59.7
+3.3  (via drill 0.5)
  Top 0.2: v130.41,17.95 130.88,17.47 139.14,17.47 141.52,19.85 v141.52,25.25
  Top 0.4: 125.7,3.02 v127.71,3.02 129.29,3.02 130.56,4.3 130.56,7.63 | v130.41,17.95 130.41,19.69 128.98,21.12 +3.3V.1
  Top 0.406: 125.7,3.02 U8.2 | 130.56,7.63 130.56,17.79 v130.41,17.95 | v94.21,27.63 v94.21,15.41 | v94.05,1.76 v94.05,3.34 | v97.86,3.34 v97.86,1.76
  Top 0.61: v34.36,60.02 50.39,60.02 52.3,61.92 90.24,61.92 93.58,58.59 98.18,58.59 v101.51,55.25 101.51,53.03 105.16,49.38 125.01,49.38 128.98,45.41 +3.3V.1 | v21.98,49.22 v16.42,43.66
  Bottom 0.2: R48.2 141.3,25.46 v141.52,25.25 141.3,25.04 R49.2 | LED.P$3 129.93,13.66 129.93,17.47 v130.41,17.95 | R55.2 24.2,60.65 26.74,63.19 | v101.51,55.25 100.19,55.25 | R70.1 119.19,1.81 119.13,1.76 | 95.68,10.21 U10.44 95.68,7.04 94.21,5.56 94.21,4.87 C53.1 94.05,4.72 v94.05,3.34 | U10.36 99.72,10.28 99.61,10.17 97.7,10.17 97.07,10.8 96.27,10.8 95.68,10.21 | U10.17 95.68,16 | 95.68,10.21 95.68,16 | 95.68,16 95.64,16.04 | FB1.1 89.29,21.92 86.27,18.9 R84.2 | R25.2 98.02,55.25 100.19,55.25 | 100.19,55.25 R24.2 | R87.1 98.5,3.98 v97.86,3.34
  Bottom 0.254: U10.44 95.68,10.05 95.64,10.09
  Bottom 0.3: R72.1 129.77,5.25 129.77,3.03 | R75.1 15.31,70.34
  Bottom 0.305: FB1.1 90.4,22.71 94.21,26.52 v94.21,27.63 94.21,28.11 94.53,28.43 94.53,29.58 VD22.C
  Bottom 0.4: C45.+ 127.23,3.5 v127.71,3.02 | 130.43,41.92 130.41,41.95
  Bottom 0.406: R67.1 16.42,25.73 | R76.1 10.23,70.34 12.77,70.34 | 12.77,70.34 15.31,70.34 18.17,70.34 18.88,71.05 | R74.1 12.77,70.34 | v127.71,3.02 C44.1 129.77,3.02 129.77,3.03 | C45.+ 125.24,2.3 124.69,1.76 119.13,1.76 108.18,1.76 | 108.18,1.76 v97.86,1.76 v94.05,1.76 82.07,1.76 SV3.1 | R80.2 108.18,1.76
  Bottom 0.61: v21.98,49.22 23.88,51.13 25.47,51.13 v34.36,60.02 34.36,61.6 32.93,63.03 26.9,63.03 26.74,63.19 18.88,71.05 10.87,79.07 10.87,82.84 C37.+ 10.87,82.92 10.87,87 | U5.2 130.41,41.95 130.41,41.92 +3.3V.1 | C34.+ 130.43,41.92 | U9.2 13.88,88.75 C38.1 13.72,88.75 12.45,88.75 10.87,87.16 10.87,87 | v16.42,43.66 16.42,25.73 | SV1.3 9.12,88.75 10.87,87
  pour Bottom: 93.42,16.04 99.45,16.04 99.45,10.01 93.42,10.01
+300V
  Bottom 0.4: C20.1 R38.1
  Bottom 0.61: C3.+ 89.45,112.88 114.05,112.88 115.64,111.29 115.64,97.8 122.15,91.29 C20.1
  Bottom 0.813: 110.74,74.76 110.72,74.78 | 110.74,74.76 110.77,74.78 VD7.A 110.09,75.44 110.09,87.48 112.31,89.7 120.09,89.7 122.15,87.64 C20.1 | 110.74,74.76 110.11,74.76 110.09,74.78 110.09,69.2 TV2.6
  Bottom 1.27: C3.+ 90.08,107.8 RT1.1
  Bottom 1.422: R4.2 R5.2 C6.1 | TV1.4 71.35,77.32 67.54,73.51 C6.1 | C6.1 49.76,74.78 C6.1.1 C5.1
  Bottom 1.676: TV1.4 71.35,83.67 63.73,91.29 C4.1 68.81,102.72 68.81,109.39 71.35,111.93 80.24,111.93 C3.+
AGND  (via drill 0.5)
  Top 1.676: C3.- C4.2
  Bottom 1.422: R23.1 R22.1 R21.1 62.14,110.66 63.73,109.07 C4.2
  other vias: 106.91,68.43 82.78,75.89 133.58,76.05 133.58,91.29 123.42,82.4 123.42,79.86 119.61,82.4 119.61,79.86 119.61,84.94 131.04,73.51 103.16,68.38 106.91,72.24 82.78,73.51 99.29,73.83 103.1,74.78 91.99,82.24 101.35,81.77 105.8,76.05 128.5,79.86 101.35,84.31
  pour Top (isolate 0.61): 134.85,67.48 134.85,93.83 119.93,93.83 116.12,90.02 98.66,90.02 96.11,87.48 79.29,87.48 74.21,82.4 54.84,82.4 53.25,80.81 53.25,76.05 57.7,71.61 94.21,71.61 98.34,67.48
  pour Bottom (isolate 0.61): 134.85,91.29 106.28,91.29 103.42,94.15 99.29,94.15 96.75,91.61 82.78,91.61 80.24,89.07 80.24,74.78 87.54,67.48 134.85,67.48
  pour Bottom (isolate 0.61, no thermals): 76.75,95.73 96.75,95.73 98.66,93.83 101.83,93.83 101.83,100.5 97.86,100.5 96.75,101.61 94.05,101.61 91.67,103.99 81.51,103.99 76.43,109.07 72.62,109.07 71.35,107.8 71.35,101.13
B
  Bottom 0.2: R57.1 X2.2
B+
  Bottom 0.2: 28.23,11.28 R68.1 | R68.1 28.59,11.38 28.65,11.44 32.62,11.44 33.41,10.65 33.41,9.38 36.11,6.68 R77.2 | B+.1 27.22,10.8 27.8,11.38 R68.1
B-
  Bottom 0.2: B-.1 25.21,33.92 R69.1 27.69,32.55 34.36,25.89 34.36,9.69 36.9,7.15 37.85,7.15 38.33,6.68 R78.2 38.33,5.72 C48.2 41.66,5.72 41.98,5.41 41.98,2.87 42.93,1.91 75.64,1.91 86.27,12.55 86.27,13.19 87.86,14.78 U10.10
BAT+  (via drill 0.5, 0.5 pad 0.5)
  Bottom 0.2: VT6.8 31.66,18.31 | 37.22,4.14 38.33,4.14 R78.1 38.43,4.08 38.49,4.14 40.4,4.14 C48.1 | 37.22,4.14 36.16,4.14 R77.1 | U10.9 88,14.28 86.75,13.03 86.75,12.39 75.8,1.44 41.5,1.44 40.71,2.23 C48.1 | v33.09,14.45 33.09,11.76 33.89,10.96 33.89,9.53 37.22,6.2 37.22,4.14 | C48.1 40.71,3.98
  Bottom 0.406: +.P$1 21.19,16.36 20.23,17.31 20.23,45.09 24.2,49.06 VD14.A
  other vias: 30.08,14.45 30.08,18.27 30.08,15.73 30.08,16.99 33.09,18.27 33.09,16.99 33.09,15.73
  pour Bottom (isolate 0.406, no thermals): 34.04,9.22 34.04,25.09 30.87,25.09 27.53,21.76 21.66,21.76 21.66,8.9 29.76,8.9 30.08,9.22
  pour Top (isolate 0.406, no thermals): 21.66,21.76 21.66,8.9 29.76,8.9 30.08,9.22 34.04,9.22 34.04,25.09 30.87,25.09 27.53,21.76
BAT-
  Bottom 0.2: VD6.A 37.55,33.18 42.93,27.79 42.93,8.26 43.41,7.79 44.39,7.79 VD24.A 44.23,6.68 43.41,6.68 43.04,6.3 R82.2
  pour Bottom (isolate 0.406, no thermals): 47.38,43.51 43.89,47 23.73,47 21.34,44.62 21.34,31.76 31.5,31.76 34.04,29.22 41.19,29.22 41.82,29.85 47.38,35.25
  pour Top (isolate 0.406, no thermals): 47.38,43.66 43.89,47 23.57,47 21.34,44.78 21.34,31.76 28.65,31.76 30.87,29.54 41.5,29.54 41.5,31.28 47.38,37.16
BZ  (via drill 0.5)
  Top 0.2: v28.65,52.4 43.41,52.4 44.36,53.35 96.43,53.35 101.19,48.59 101.19,39.22 v101.51,38.9 109.93,30.49 v109.93,21.44 | v32.14,55.89 29.28,55.89 19.76,65.41 X5.1 | U8.30 109.29,11.91 109.93,12.55 v109.93,13.03
  Bottom 0.2: v28.65,52.4 v32.14,55.89 | R75.2 15.31,67.64 16.58,66.37 X5.1 | v101.51,38.9 DVT2.B | v109.93,13.03 v109.93,21.44
C
  Bottom 0.2: R56.2 X2.1
CH  (via drill 0.5)
  Top 0.2: v98.97,41.6 98.66,41.28 98.66,36.84 97.54,35.73 97.54,34.38 98.66,33.27 98.66,31.92 100.24,30.33 CH.1 v100.24,19.22
  Bottom 0.2: VT7.1 99.29,42.55 98.97,42.24 v98.97,41.6 | U10.24 99.18,18.16 v100.24,19.22
CH-
  Bottom 0.2: R83.1 49.55,3.56 49.76,3.34 75.16,3.34 84.84,13.03 84.84,14.61 86.01,15.78 U10.12
CS  (via drill 0.5)
  Top 0.2: v18.96,66.68 19.76,66.68 29.28,57.16 51.82,57.16 53.89,59.22 89.29,59.22 92.62,55.89 97.23,55.89 98.81,54.3 98.81,52.24 102.15,48.9 102.15,40.01 112.94,29.22 112.94,25.73 112.31,25.09 112.31,20.96 111.99,20.65 U8.23
  Bottom 0.2: R74.2 12.77,67.64 14.04,66.37 X5.2 14.04,64.62 15.47,63.19 17.85,63.19 18.96,64.3 v18.96,66.68
D20_RES  (via drill 0.5)
  Top 0.2: v105.8,4.3 U8.36
  Bottom 0.2: SV3.10 91.27,2.55 102.94,2.55 103.42,3.02 104.27,3.02 R79.2 | C55.2 108.18,4.54 U8.36 | R79.2 104.37,3.18 | R79.2 104.37,3.02 105.16,3.02 105.8,3.66 v105.8,4.3 U8.36 | U8.36 108.08,4.3 R80.1
D+
  Bottom 0.2: U6.3 142.54,9.44 144.69,11.6 145.98,11.6 X4.D+
D-
  Bottom 0.2: U6.4 143.04,8.99 144.38,10.33 145.23,10.33 X4.D-
DAC  (via drill 0.5)
  Top 0.2: DAC.1 92.94,38.9 92.94,27.47 93.42,27 93.42,13.19 v94.05,12.55
  Bottom 0.2: OPTV1.2 97.7,59.7 97.38,60.02 91.51,60.02 91.35,59.86 91.35,57.79 92.62,56.52 92.62,41.28 92.94,40.97 R26.2 93.52,39.48 DAC.1 | U10.3 93.25,11.28 94.05,12.07 v94.05,12.55
DC  (via drill 0.5)
  Top 0.2: v12.61,98.91 12.61,74.46 29.44,57.63 51.51,57.63 53.57,59.7 89.45,59.7 92.78,56.37 97.38,56.37 99.29,54.46 99.29,52.4 102.62,49.06 102.62,40.17 119.77,23.03 v119.77,21.44 | U8.11 123.42,14.45 121.36,16.52 v120.4,16.52
  Bottom 0.2: U9.6 v12.61,98.91 9.12,98.91 7.85,100.18 5.95,100.18 5.15,99.39 5.15,97.8 SV1.6 | v119.77,21.44 119.77,17.15 v120.4,16.52
DIN
  Bottom 0.2: U10.13 93.68,23.61 DIN.1 97.7,29.58 VD22.A 97.86,29.7 97.86,31.82 R29.2
DIN1  (via drill 0.5)
  Top 0.2: v94.69,31.92 93.42,33.19 93.42,37.47 94.37,38.43 94.37,47.95 91.83,50.49 79.66,50.49 77.6,48.43 VT2.S
  Bottom 0.2: R29.1 v94.69,31.92
  Bottom 1.676: R35.2 R33.2 77.76,31.54 77.7,31.6 77.7,35.67 R32.2 R34.2 77.76,42.71 | 77.76,42.71 77.76,46.05 VT2.S R31.2 | R30.2 77.6,42.55 77.76,42.71
  Bottom 2.54: VT2.S
DN
  Bottom 0.2: R58.1 X2.3
DTR  (via drill 0.5)
  Top 0.2: v139.3,5.88 139.77,6.36 v139.77,13.03
  Bottom 0.2: U6.23 139.5,5.68 v139.3,5.88 | VT4.2 138.29,12.08 R50.2 139.35,12.13 139.77,12.55 v139.77,13.03
EN  (via drill 0.5)
  Top 0.2: v150.72,11.6 152.31,10.01 152.31,3.34 150.41,1.44 135.33,1.44 134.37,2.39 134.37,4.3 v133.74,4.93 v133.74,8.42 | U8.3 127.23,4.3 v128.02,5.09
  Bottom 0.2: v133.74,4.93 133.42,5.25 R72.2 131.57,5.98 131.36,6.2 129.13,6.2 v128.02,5.09 | R73.1 v150.72,11.6 C46.2 | VT3.3 134.07,8.75 v133.74,8.42
FAN  (via drill 0.5)
  Top 0.2: U8.12 126.59,15.73 128.02,17.15 v128.02,19.85
  Bottom 0.2: v128.02,19.85 DVT3.B
FOFF  (via drill 0.5)
  Top 0.2: v18.33,48.11 18.33,50.33 18.8,50.81 43.73,50.81 45.31,52.4 96.11,52.4 98.5,50.02 98.5,48.43 99.13,47.79 99.13,44.62 100.24,43.51 100.24,37 101.19,36.05 101.19,34.62 103.26,32.55 FOFF.1 108.97,29.38 108.97,22.71 v107.7,21.44 | U8.33 106.75,8.1 105.64,9.22 v105.64,9.38
  Bottom 0.2: R63.1 11.82,33.35 12.93,34.46 14.2,34.46 | VD19.C 14.2,43.98 v18.33,48.11 | 105.64,12.07 106.43,12.87 106.43,20.17 v107.7,21.44 | U10.32 101.87,12.28 102.94,13.34 104.37,13.34 105.64,12.07 | 105.64,12.07 v105.64,9.38
  Bottom 0.254: VD19.C 14.2,34.46
G  (via drill 0.5)
  Top 0.2: v27.69,8.26 30.39,10.96 32.93,10.96 34.2,9.69 v38.49,9.69 41.5,9.69 42.93,11.12 42.93,20.01 42.3,20.65 v40.23,20.65
  Bottom 0.2: R62.1 17.53,8.74 18.01,8.26 v27.69,8.26 | v38.49,9.69 R61.1 39.86,10.43 40.51,11.08 VD18.C 40.51,13.07 40.08,13.5 37.38,13.5 37.1,13.78 VT6.4 | VT5.4 40.19,20.6 v40.23,20.65
GND  (via drill 0.5)
  Top 0.61: 48.49,55.73 48.65,55.89 52.46,55.89 54.52,57.95 88.65,57.95 92.15,54.46 v93.58,54.46
  Bottom 0.2: U6.2 142.04,7.9 v141.2,8.74 | U10.18 96.18,18.52 v96.11,18.58 | U10.42 96.68,10.08 v96.67,10.09 | U10.5 89.56,12.28 v89.29,12.55 | VD23.C 48.17,11.28 48.49,10.96 48.49,7.95 49.12,7.31 VD24.C 48.33,6.07 48.33,3.34 48.81,2.87 75.32,2.87 85.32,12.87 85.32,13.98 v86.27,14.93 | U10.35 99.16,10.78 v98.66,11.28
  other vias: 109.29,57.95 78.97,1.44 132.63,48.43 111.35,12.07 18.17,15.57 12.3,20.96 4.04,84.94 15.47,78.59 4.04,81.13 4.04,77.32 4.04,88.75 4.04,92.56 4.04,96.37 4.04,100.18 4.04,103.99 135.49,16.36 133.74,11.28 146.28,7.47 139.93,27.79 131.04,30.33 141.2,13.82 117.07,31.6 115.32,35.89 132.94,3.02 111.35,3.02 113.9,27.31 15.47,15.57 4.04,69.7 104.21,51.92 11.82,40.65 8.01,6.2 8.01,44.62 4.04,64.78 18.49,78.59 18.49,82.88 9.76,15.57 122.15,50.65 123.42,58.27 96.43,43.03 123.58,20.96 122.15,17.15 118.5,14.93 11.82,36.2 130.09,35.41 131.04,22.71 121.99,22.23 126.12,20.96 133.58,39.22 130.25,38.27 139.93,20.17 131.68,16.36 135.8,2.39 147.55,2.39 45.79,54.78 39.92,54.78 125.8,42.08 114.53,17.15 25.63,6.2 121.2,8.58 121.83,35.89 120.88,31.6 128.18,48.43 8.01,52.08 15.63,20.96 122.15,39.7 106.59,46.84 106.59,44.3 122.15,45.57 117.07,45.57 110.09,40.01 8.96,60.81 104.21,55.41 11.5,69.38 103.89,30.01 105.64,30.01 45.63,49.06 97.54,4.77 96.27,48.59 114.53,30.01 35.63,54.78 39.92,64.14 43.09,64.14 131.68,19.38 28.8,61.29 25.31,57.95 107.7,37.16 104.37,40.33 96.91,25.57 93.42,7.47 102.78,18.27 110.56,9.38 118.5,17.15 118.34,21.44 128.02,8.1 132.31,8.26 142.31,11.76 114.69,21.44 102.15,28.9 113.26,21.44 115.96,4.61 86.43,10.65 120.56,3.5 99.45,30.01 105.96,7.47 88.97,17.95 14.04,69.38 96.11,33.35 96.43,46.05 101.99,25.57 131.68,46.05 96.59,54.46 94.69,54.46 107.55,19.53 95,48.59 97.38,53.67 93.58,49.86 95.8,27.63 105.64,23.19 103.73,23.19 107.07,29.22 100.16,33.11 98.97,25.57 90.88,4.77 101.35,9.38 103.42,20.49 123.42,23.5 126.44,23.5 96.43,39.54 15.15,40.65 18.17,40.65 15.15,36.2 18.17,36.2 18.17,28.74 15.15,28.74
  pour Top (isolate 0.406, rank 2): 152.95,0.64 152.95,30.01 138.5,30.01 136.6,31.92 136.6,60.49 94.37,60.49 90.72,64.14 49.28,64.14 47.86,65.57 27.85,65.57 20.55,72.88 20.55,83.03 18.65,84.94 18.65,88.75 20.55,90.66 20.55,112.25 0.55,112.25 0.55,63.19 6.26,63.19 6.26,0.64
  pour Bottom (isolate 0.406, rank 2): 152.95,0.64 152.95,30.01 138.5,30.01 136.6,31.92 136.6,60.49 82.14,60.49 78.34,64.14 49.28,64.14 47.86,65.57 27.85,65.57 20.55,72.88 20.55,83.03 18.65,84.94 18.65,88.75 20.55,90.66 20.55,112.25 0.55,112.25 0.55,63.19 6.26,63.19 6.26,0.64
  pour Top: 85.95,11.76 91.51,11.76 93.1,12.71 92.46,19.69 91.67,20.49 90.4,20.49 85.95,16.04
  pour Bottom (isolate 0.406): 85.95,15.09 88.5,15.09 90.24,16.84 90.24,20.01 89.61,20.65 88.5,20.65 85.95,18.11
HS2
  Bottom 1.422: C5.2 47.22,88.43 R6.1 R7.1 54.68,98.12 VD2.C
IO0  (via drill 0.5)
  Top 0.2: U8.25 109.45,18.27 112.31,15.41 v112.31,14.77
  Bottom 0.2: VT4.3 131.83,13.03 129.93,11.12 127.23,11.12 126.59,11.76 121.52,11.76 119.77,13.5 113.58,13.5 v112.31,14.77
KEY  (via drill 0.5)
  Top 0.2: v30.55,59.7 31.19,59.06 50.55,59.06 52.62,61.13 89.92,61.13 93.26,57.79 97.86,57.79 100.72,54.94 100.72,52.87 105,48.59 124.85,48.59 127.87,45.57 127.87,39.54 128.34,39.06 128.34,20.8 129.29,19.85 129.29,17.63 129.93,16.99 129.93,11.6 126.44,8.1 U8.6
  Bottom 0.2: v30.55,59.7 25.31,54.46 24.2,54.46 R55.1 24.15,54.46 21.66,54.46 R56.1 21.6,54.46 19.12,54.46 R57.2 19.06,54.46 16.58,54.46 R58.2 16.52,54.46 14.04,54.46 R59.2 13.98,54.46 11.5,54.46 R60.1 10.92,54.4 10.23,55.09 10.23,63.19 8.96,64.46 X5.4 8.96,66.37 10.23,67.64 R76.2
LEDB  (via drill 0.5)
  Top 0.2: v113.42,15.25 110.72,17.95 U8.24
  Bottom 0.2: v113.42,15.25 113.42,14.77 114.21,13.98 121.04,13.98 122.78,15.73 123.42,15.73 123.84,16.15 R52.1
LEDG  (via drill 0.5)
  Top 0.2: v122.63,13.82 123.26,13.19 U8.10
  Bottom 0.2: v122.63,13.82 123.58,13.82 123.84,14.08 R53.1
LEDR  (via drill 0.5)
  Top 0.2: v122.63,12.55 123.26,11.91 U8.9
  Bottom 0.2: R54.1 122.78,12.71 v122.63,12.55
N$1
  Bottom 0.61: R37.1 R36.2
N$2
  Bottom 0.254: U6.5 U6.6
  Bottom 0.3: U6.6 144.04,8.09 144.53,8.58 C36.1
N$3
  Bottom 1.422: R7.2 R6.2 R4.1 R5.1
N$4
  Bottom 1.422: VD3.C 54.71,87.96 VD2.A
N$5
  Top 1.422: 81.35,86.21 79.6,87.96 VD3.A 70.4,94.47 58.97,94.47 56.34,97.09 C12.1
  Top 1.676: VT1.D 86.59,86.21 81.35,86.21 TV1.2
N$6
  Bottom 1.422: R21.2 R22.2 R23.2 33.48,97.09 C12.2
N$7
  Top 2.54: RU1.2 134.37,107.48 X1.P$2
  Bottom 1.27: L1.3 125.61,110.02 C1.2 127.9,110.02 X1.P$2
  Bottom 2.54: RU1.2 134.37,107.48 X1.P$2
N$8
  Bottom 1.27: VD1.+ 95.64,109.86 RT1.2
N$9
  Bottom 0.2: X3.3 127.39,27.47 126.65,26.73 R90.1
N$10  (via drill 0.5)  (1 unrouted)
  Top 0.406: v85.48,84.31 89.45,84.31 90.72,85.58 v92.62,85.58
  Bottom 0.4: R16.2 94.71,85.36 VD4.A | 85.48,84.78 v85.48,84.31
  Bottom 0.406: 83.95,85.26 VT1.G | v92.62,85.58 VD4.A | 85.48,84.78 85.48,84.94 85.16,85.26 R14.2
N$11
  Bottom 0.406: TV1.9 PAD2.1
N$12
  Bottom 0.2: R15.2 99.45,91.77 97.23,93.99 94.95,93.99
  Bottom 0.254: 94.9,93.83 R17.2 94.95,93.99
  Bottom 0.4: R16.1 97.23,88.43 96.59,89.07 VT1.S
  Bottom 1.016: R18.2 89.82,93.89 89.77,93.83 | 86.01,93.83 R19.2 85.06,93.89 85,93.83 | 81.57,93.83 R20.2 | 94.95,93.78 R17.2
  Bottom 1.27: R17.2 R18.2 | 89.77,93.83 86.01,93.83 | 85,93.83 81.57,93.83 | VT1.S 94.95,93.78
N$13
  Bottom 1.27: L1.2 105.83,97.32 C2.1 104.69,99.86 102.31,102.24 VD1.AC1
N$14
  Top 2.54: X1.P$1 134.37,99.86 RU1.1
  Bottom 1.27: L1.1 125.61,97.32 C1.1 127.9,97.32 X1.P$1
  Bottom 2.54: RU1.1 134.37,99.86 X1.P$1
N$15
  Bottom 1.27: L1.4 105.83,110.02 C2.2 103.26,109.74 103.26,107.01 102.31,106.05 VD1.AC2
N$16
  Bottom 0.61: R37.2 112.46,78.27 114.85,78.27 115.64,77.48 117.18,77.48 U3.5 117.22,77.48
  Bottom 0.813: 117.22,77.48 117.7,77.48 117.7,71.1 VD8.A 117.7,70.81 117.7,69.68 TV2.4
N$17
  Bottom 0.406: U1.6 O1.1 93.26,83.35 R13.1 | R14.1 R13.1 | R13.1
N$18
  Bottom 0.406: VD4.C 89.8,85.26 R13.2
N$19
  Bottom 0.61: R36.1 114.21,86.37 114.53,86.69 C21.1
N$20
  Bottom 0.4: U3.1 128.26,84.76 C22.1
N$21
  Bottom 0.4: R39.1 131.68,85.1 129.29,87.48 R38.2
N$22
  Bottom 0.254: R39.2 131.68,75.41 132.31,74.78 132.31,68.75 132.63,68.43 OPTV3.4
  Bottom 0.4: U3.4 131.37,77.5 R39.2
N$23
  Bottom 0.2: R40.2 125.54,49.48 125.48,49.54 125.48,51.55 R41.1 125.54,52.29 125.96,52.71 132.47,52.71 TP11.TP 134.22,54.46 134.22,57.32 133.58,57.95 OPTV3.1
N$24
  Bottom 0.4: VD9.A 121.52,68.57 TV2.2
N$25
  Bottom 0.2: R24.1 OPTV1.1
N$26
  Bottom 0.813: VD7.C 115.14,71.27 114.69,70.81 VD8.C
N$27  (via drill 0.5)
  Top 0.2: v98.18,79.38 v98.18,80.97
  Bottom 0.2: U1.3 93.89,76.69 94.53,77.32 96.75,77.32 98.18,78.75 v98.18,79.38 | v98.18,80.97 98.18,83.03 C11.1 98.28,83.61 99.45,84.78 R15.1
  Bottom 0.254: R15.1 99.55,85.36 99.61,85.42
N$28
  Bottom 0.2: SV1.1 C39.1
N$29  (via drill 0.5)
  Top 0.2: S1.P$1 v102.94,4.93
  Bottom 0.2: U10.40 97.68,7.81 98.02,7.47 101.67,7.47 102.94,6.2 v102.94,4.93 104.27,4.93 R79.1 104.31,4.77
N$30
  Bottom 0.2: OPTV2.4 R12.1 | U1.1 96.43,71.29 95.96,70.81 95.16,70.81 93,70.81 C9.2 92.88,70.81
  Bottom 0.254: R12.1 95.16,70.81 95.16,70.97
N$31
  Bottom 0.2: R10.2 97.7,76.05 97.07,76.69 95.48,76.69 95.16,76.37 U1.2 R12.2 95.16,72.4 93,72.4 C9.1
N$32
  Bottom 0.2: 97.7,70.65 100.14,70.65 | R10.1 OPTV1.3
  Bottom 0.254: R10.1 97.7,70.65 | 100.14,70.65 R11.2
N$33
  Bottom 0.2: U1.8 96.43,78.59 95.8,77.95 93.26,77.95 91.35,76.05 90.5,76.05 | OPTV1.4 101.2,68.44 101.51,68.75 101.51,77.32 98.66,80.18 96.49,80.18 | R9.1 90.4,76.05 89.45,76.05 89.13,75.73 89.13,74.46 88.81,74.14 87.96,74.14 C7.1
  Bottom 0.254: 96.49,80.18 U1.8 | 90.5,76.05 R9.1
N$34
  Bottom 0.2: 92.62,74.46 90.61,74.46 | R9.2 90.4,73.51 90.08,73.19 87.7,73.19 87.22,72.72 5.TP 85.8,72.72 85.32,73.19 C8.1
  Bottom 0.254: U1.4 92.56,75.1 92.56,74.52 92.62,74.46 | 90.61,74.46 R9.2
N$35  (via drill 0.5)
  Top 0.305: v93.42,47.79 90.19,47.79 VT2.G
  Bottom 0.305: U2.4 95.48,46.68 95.32,46.52 93.79,46.52 R27.1 93.73,47.48 v93.42,47.79
N$36
  Bottom 0.2: U10.2 89.79,10.78 C52.1 89.66,9.91 89.29,9.53 86.11,9.53 85.48,8.9 85.48,8.02 Y1.P$1
N$37
  Bottom 0.305: SG1.- 95.4,37.23 96.11,37.95 DVT2.C
N$38
  Bottom 0.2: U2.3 95.34,44.88 R27.2 93.73,43.24 R28.1
N$39
  Bottom 0.2: R53.2 127.31,14.77 LED.P$2
N$40
  Bottom 0.2: R52.2 127.23,16.84 127.87,16.2 LED.P$1
N$41
  Bottom 0.2: R26.1 96.59,40.97 97.23,41.6 VT7.3 98.02,41.6 98.02,43.19 97.38,43.82 U2.1
N$42
  Bottom 0.406: C6.2 51.03,63.35 PAD3.1
N$43
  Bottom 0.2: U10.4 88.47,11.78 REFA.TP
N$44
  Bottom 0.2: R54.2 127.15,12.71 LED.P$4
N$45
  Bottom 0.406: VD11.C 120.88,58.91 122.95,56.83 TV2.10
N$46
  Bottom 0.4: VD10.A 113.58,53.19 112.49,54.28 112.49,55.8 TV2.7
  Bottom 0.406: VD12.A 109.42,55.83 TV2.7
N$47
  Bottom 0.2: Y1.P$2 88.47,7.63 C51.1 90.24,7.69 90.24,9.06 91.46,10.28 U10.1
N$48
  Bottom 0.4: X3.1 138.15,26.71 VD20.A 138.15,20.42 C47.- 135.99,20.8 DVT3.C
N$49
  Bottom 1.016: R8.2 C13.1
N$50  (via drill 0.5)
  Top 0.4: v96.27,49.86 v95,49.86 93.58,51.28 46.27,51.28 v44.05,49.06
  Bottom 0.305: 104.05,47.79 104.09,47.79 C30.+
  Bottom 0.4: U4.6 110.72,44.3 110.09,44.94 110.09,45.47 R45.1 | v96.27,49.86 v95,49.86
  Bottom 0.406: v44.05,49.06 VD14.C | R45.1 105,45.57 104.37,46.2 C30.+ | C30.+ 104.37,49.7 107.55,52.87 110.72,52.87 111.83,51.76 111.83,50.81 113.26,49.38 VD13.C | v96.27,49.86 96.91,49.86 98.97,47.79 104.05,47.79 | 104.33,48.11 C30.+
N$51
  Bottom 0.2: R49.1 LEDR.A
N$52
  Bottom 0.2: R48.1 143.74,26.84 LEDG.A
N$53
  Bottom 0.2: 12.3,10.17 13.72,8.74 R62.2 | 12.3,10.17 OPTV4.3 | 12.3,10.17 DVT1.C
N$54
  Bottom 0.2: OPTV4.4 9.76,9.69 9.28,9.22 DVT1.B
  Bottom 0.254: DVT1.B
N$55
  Bottom 0.2: R66.2 VD21.A 16.42,11.28 15.63,12.07 OPTV5.2
N$56
  Bottom 0.2: R64.1 11.72,28.9 | 9.6,29.06 11.76,29.06 | VD19.A 14.2,30.01 13.25,29.06 11.88,29.06
  Bottom 0.254: 11.72,28.9 R63.2 | R65.2 9.6,29.06 | 11.76,29.06 R63.2 | 11.88,29.06 R63.2
N$57
  Bottom 0.2: U10.33 X6.2
N$58
  Bottom 0.2: U10.34 101.36,11.28 101.67,10.96 101.67,10.17 102.78,9.06 104.05,9.06 104.53,9.53 104.53,10.23 X6.3
N$59  (via drill 0.5)
  Top 0.2: X6.4 102.64,9.39 101.51,8.26 v101.51,6.36
  Bottom 0.2: R87.2 101.04,4.03 101.04,5.88 v101.51,6.36 101.35,6.52 R81.2
N$61
  Top 0.2: U8.37 IO23.P$1
N$62
  Top 0.2: U8.31 106.59,10.65 IO19.P$1
N$63
  Bottom 0.2: R73.2 151.57,14.67 152,15.09 152,21.69 SW1.1
N$64
  Bottom 0.4: U4.7 111.99,45.47 R45.2
  Bottom 0.406: U4.1 U4.8 U4.7
N$65
  Bottom 0.4: U4.2 111.99,35.57 112.94,34.62 112.94,32.36 VD15.C 114.85,32.23 115.64,31.44 115.64,29.7 116.74,28.6 L2.2
N$66
  Bottom 0.3: U4.3 110.72,35.83 C31.1
N$67  (via drill 0.5)
  Top 0.2: v111.99,40.01 112.62,39.38 v117.7,39.38
  Bottom 0.2: U4.5 109.45,41.76 109.93,41.28 110.72,41.28 v111.99,40.01 | R47.1 R46.2 117.76,39.32 v117.7,39.38
N$68
  Top 0.2: U8.26 106.59,16.99 106.28,17.31 106.28,19.38 IO4.P$1
N$69  (via drill 0.5)
  Top 0.2: v134.53,30.33 134.53,31.76
  Top 0.4: v134.53,34.77 v134.53,30.33 135.01,29.85 145.49,29.85 146.92,28.43 v146.92,15.57
  Bottom 0.305: VD25.C 131.33,29.19 131.99,29.85 134.06,29.85 v134.53,30.33
  Bottom 0.4: U5.3 127.7,42.05 | 129.96,37.12 VD16.C 132.47,35.57 133.26,34.77 v134.53,34.77
  Bottom 0.406: VD17.C 145.93,16.55 v146.92,15.57 | 127.7,42.05 127.7,39.83 C33.+ 127.87,39.67 127.87,38.59 129.33,37.12 129.96,37.12
N$70
  Bottom 0.2: VR1.2 126.76,57.32 126.75,57.32 126.75,55.31 R42.1 126.81,54.36 125.33,52.87 124.21,52.87 123.84,52.5 R41.2
N$71
  Bottom 0.2: R51.1 140.56,13.5 140.09,13.98 VT4.1
N$72
  Bottom 0.2: VT3.1 138.29,10.48 R50.1
N$73
  Bottom 0.2: OPTV3.2 129.3,58.9 TP12.TP | TP12.TP 129.13,59.22 | VR1.1 TP12.TP
N$74
  Bottom 0.2: U10.39 98.18,8.1 98.34,7.95 99.92,7.95 PA28.P$1
N$75
  Bottom 0.2: U10.31 101.58,12.78 101.83,13.03 101.83,15.88 PA22.P$1
NEGIN  (via drill 0.5)
  Top 0.2: v20.55,51.6 43.57,51.6 44.84,52.87 96.27,52.87 100.72,48.43 100.72,37.79 101.99,36.52 103.26,36.52 109.45,30.33 109.45,22.08 109.13,21.76 v109.13,19.53 | U8.5 123.1,6.84 v122.63,7.31
  Bottom 0.2: OPTV5.4 18.17,25.62 | v20.55,51.6 20.55,46.36 19.6,45.41 19.6,26.36 19.06,25.83 18.17,25.83 R67.2 | v122.63,7.31 122.15,6.84 114.85,6.84 109.13,12.55 v109.13,19.53
  Bottom 0.254: 18.17,25.62 R67.2
OFF  (via drill 0.5)
  Top 0.2: v95.64,51.13 96.11,51.13 97.54,49.7 97.54,48.11 98.18,47.48 98.18,37.08 96.99,35.89 96.99,34.22 98.18,33.03 98.18,29.7 96.59,28.11 96.59,27.16 97.7,26.04 v97.7,19.22
  Bottom 0.2: OPTV2.1 95.16,57.32 95.64,56.84 | 95.64,56.84 97.96,56.84 R25.1 | 95.64,56.84 v95.64,51.13 | U10.23 98.68,18.24 v97.7,19.22
ONSW  (via drill 0.5)
  Top 0.2: v19.12,50.02 19.28,50.17 44.05,50.17 45.79,51.92 95.96,51.92 98.02,49.86 98.02,48.27 98.66,47.63 98.66,44.3 99.77,43.19 99.77,36.84 100.72,35.89 100.72,34.3 103.58,31.44 106.28,31.44 108.5,29.22 108.5,23.5 v107.7,22.71 | v105.64,13.66 106.12,13.19 U8.29
  Bottom 0.2: R65.1 9.6,31.6 8.8,32.39 8.8,41.28 17.53,50.02 v19.12,50.02 | v105.64,13.66 105.8,13.82 105.8,20.8 v107.7,22.71
P
  Bottom 0.2: R60.2 X2.5
PA28
  Bottom 0.2: U10.41 97.18,6.72 97.38,6.52 R81.1
PG
  Top 0.4: C47.+ 133.71,25.38 134.85,26.52 X3.2
  Bottom 0.4: R43.1 132.73,18.56 C47.+ | VD20.C 133.58,23.47 133.58,25.25 134.85,26.52 X3.2 134.85,28.27 135.49,28.9 PG.1 135.49,46.2 134.53,47.16 113.74,47.16
  Bottom 0.406: 113.74,47.16 113.58,47.16 112.62,48.11 C29.1 110.56,49.06 109.29,50.33 VD12.C
PGU  (via drill 0.5)
  Top 0.2: v132.31,11.12 v132.31,15.09 | U8.4 127.23,5.56 129.45,7.79 v129.45,8.9
  Bottom 0.2: v129.45,8.9 130.56,8.9 132.31,10.65 v132.31,11.12 | v132.31,15.09 132.94,15.09 134.43,16.58 R43.2 R44.2
PLUS  (via drill 0.5)
  Bottom 0.406: C16.1 78.14,17.12 C14.+ | C17.1 C15.+
  other vias: 44.05,16.99 44.05,18.27 47.22,16.99 47.22,19.53 44.05,15.73 44.05,19.53 47.22,15.73 47.22,18.27
  pour Bottom (isolate 0.406, no thermals): 43.57,24.3 43.57,7.95 48.17,7.95 48.17,13.5 50.08,15.41 50.08,21.92 47.7,24.3
  pour Top (isolate 0.406, no thermals): 43.41,5.72 43.41,31.28 48.97,36.84 48.97,48.11 51.66,50.81 88.65,50.81 91.83,47.63 91.83,23.03 85.16,16.36 85.16,12.39 76.27,3.5 45.63,3.5
RES  (via drill 0.5)
  Top 0.2: U8.8 122.94,10.65 v122.63,10.96 | v11.02,96.37 11.02,75.26 18.01,68.27 18.01,66.37 18.49,65.89 19.91,65.89 29.12,56.68 52.14,56.68 54.2,58.75 89.13,58.75 92.46,55.41 97.07,55.41 98.34,54.14 98.34,52.08 101.67,48.74 101.67,39.86 112.47,29.06 112.47,25.89 111.51,24.93 v111.51,21.44
  Bottom 0.2: v111.51,21.44 111.51,14.14 112.62,13.03 119.45,13.03 121.52,10.96 v122.63,10.96 | U9.5 v11.02,96.37 9.12,96.37 SV1.7
RT  (via drill 0.5)
  Top 0.2: v114.21,3.98 112.78,5.41 112.78,11.28 116.44,14.93 v116.44,16.2 | v116.44,21.44 SENSOR.2
  Bottom 0.2: R70.2 114.85,3.34 v114.21,3.98 | v116.44,16.2 v116.44,21.44 | R71.1 116.02,24.08 SENSOR.2
RTS  (via drill 0.5)
  Top 0.2: v139.3,3.34 138.5,4.14 138.5,8.1 v138.98,8.58
  Bottom 0.2: R51.2 140.56,9.38 139.77,8.58 v138.98,8.58 v138.97,8.58 VT3.2 | U6.19 139.63,3.68 v139.3,3.34
RTU  (via drill 0.5)
  Top 0.2: RTU.1 110.72,25.73 v110.72,22.71 | U8.7 122.78,9.38 v122.63,9.53
  Bottom 0.2: v110.72,22.71 110.72,14.3 112.47,12.55 119.13,12.55 122.15,9.53 v122.63,9.53 123.1,10.01 C43.1 | U10.14 94.18,23.32 95.64,24.77 103.1,24.77 103.58,24.3 105.96,24.3 107.39,25.73 110.72,25.73 RTU.1 111.99,25.73 R71.2
RX
  Bottom 0.2: U10.16 95.18,21.14 95.96,21.92 97.7,21.92 SV2.3
RX2
  Top 0.2: U8.27 106.43,15.73 105.8,16.36 105.8,18.58 104.69,19.69 102.47,19.69 SV2.2
SCL
  Top 0.2: U8.13 126.59,16.99 127.23,17.63 127.23,20.17 127.87,20.8 127.87,38.9 127.39,39.38 127.39,45.41 124.69,48.11 104.85,48.11 100.24,52.71 100.24,54.78 97.7,57.32 93.1,57.32 89.77,60.65 52.94,60.65 50.87,58.59 29.76,58.59 14.2,74.14 14.2,90.34 15.15,91.29 U9.3
  Bottom 0.2: SV1.5 8.01,93.83 10.55,91.29 U9.3
SDA  (via drill 0.5)
  Top 0.2: v13.41,93.83 13.41,74.3 29.6,58.11 51.19,58.11 53.25,60.17 89.61,60.17 92.94,56.84 97.54,56.84 99.77,54.62 99.77,52.55 103.1,49.22 103.1,40.33 120.88,22.55 U8.16
  Bottom 0.2: U9.4 v13.41,93.83 8.96,93.83 7.69,95.1 5.95,95.1 5.31,94.47 5.31,92.56 SV1.4
SH+
  Bottom 0.2: U10.11 87.73,15.28 85.8,13.34 85.8,12.71 75.48,2.39 45.31,2.39 44.68,3.02 44.68,4.24 R82.1
SHUNT-
  Bottom 0.2: R1.1 51.03,15.25 48.97,13.19 48.97,9.69 49.28,9.38 51.03,9.38 51.51,8.9 51.51,4.56 R83.2 52.14,4.3 52.62,3.82 75,3.82 84.37,13.19 84.37,14.88 86.11,16.62 R84.1
  pour Bottom (isolate 0.406, no thermals): 53.09,4.3 74.84,4.3 83.57,13.03 83.57,14.93 84.84,16.2 84.84,18.58 92.31,26.04 92.31,56.37 91.03,57.63 91.03,60.33 82.3,60.33 78.49,64.14 48.81,64.14 48.49,63.83 48.49,62.4 50.24,60.65 74.21,60.65 74.21,51.28 57.86,34.93 49.12,34.93 43.57,29.38 43.57,25.73 47.38,25.73 51.35,21.76 51.35,15.09 49.28,13.03 49.28,10.33 49.76,9.85 51.51,9.85 51.98,9.38 51.98,5.41
SWCLK
  Bottom 0.2: U10.45 95.18,7.33 93.89,6.04 83.91,6.04 SV3.4
SWDIO
  Bottom 0.2: U10.46 94.68,7.47 93.73,6.52 82.38,6.52 SV3.2
TOV2
  Bottom 0.2: R64.2 10.02,23.3
  Bottom 0.254: 10.02,23.3 OPTV4.1
TS  (via drill 0.5)
  Top 0.2: U8.14 125.01,18.27 v125.01,23.82
  Bottom 0.2: v125.01,23.82 R90.2 125.01,25.09 123,25.09 R89.1
TX
  Bottom 0.2: U10.15 94.68,23.02 95.96,24.3 100.4,24.3 SV2.1
TX2
  Top 0.2: SV2.4 98.97,19.38 99.92,18.42 100.88,18.42 101.67,19.22 104.53,19.22 105.32,18.42 105.32,15.88 106.75,14.45 U8.28
U0RX  (via drill 0.5)
  Top 0.2: v135.96,6.2 135.96,14.3 137.23,15.57 139.93,15.57 143.74,19.38 143.74,24.3 LEDG.K | U8.34 v110.09,6.84
  Bottom 0.2: v110.09,6.84 110.72,6.84 111.2,6.36 127.71,6.36 128.5,7.15 134.06,7.15 135.01,6.2 v135.96,6.2 136.91,6.2 138.43,4.68 U6.21
U0TX  (via drill 0.5)
  Top 0.2: v136.75,4.61 136.75,14.14 137.71,15.09 140.09,15.09 145.01,20.01 LEDR.K | U8.35 v110.09,5.56
  Bottom 0.2: v110.09,5.56 110.4,5.88 128.02,5.88 128.82,6.68 133.74,6.68 135.8,4.61 v136.75,4.61 137.19,4.18 U6.20
U1VCC  (via drill 0.5)
  Top 0.4: 102.47,73.51 VCC.1
  Top 0.406: v90.4,77.32 91.03,76.69 99.29,76.69 102.47,73.51
  Bottom 0.4: VD9.C 121.52,73.19 | C23.+ 124.28,73.95 C24.1 124.06,73.67 121.56,73.67 VD9.C | VD9.C 121.47,73.62 121.36,73.51 VCC.1
  Bottom 0.406: U1.7 95.16,78.91 94.84,78.59 90.72,78.59 C10.1 v90.4,77.32
UP
  Bottom 0.2: R59.1 X2.4
VD+  (via drill 0.5)
  Top 0.4: v32.62,60.02 34.68,62.08 50.39,62.08 51.66,63.35 90.88,63.35 94.05,60.17 101.67,60.17 102.91,58.94 C27.+ 104.18,60.17 115.11,60.17 TV2.9
  Bottom 0.305: VD+.1 102.94,55.57 103.73,56.37 C28.1
  Bottom 0.4: v32.62,60.02 25.47,52.87 22.14,52.87
  Bottom 0.406: C28.1 103.74,58.08 C27.+ | 22.14,52.87 19.44,52.87 8.17,41.6 8.17,12.39 8.48,12.07 8.48,11.19 DVT1.E
VD-  (via drill 0.5)
  Top 0.4: v47.22,61.13 50.39,61.13 51.98,62.72 90.56,62.72 93.89,59.38 99.77,59.38 101.51,57.63 105.2,57.63 C27.-
  Top 0.406: 41.82,21.76 42.3,21.76 42.3,30.96 48.17,36.84 48.17,48.11 v47.22,49.06
  Bottom 0.3: VD-.1 105.48,56.84 C28.2
  Bottom 0.4: v47.22,49.06 v47.22,61.13
  Bottom 0.406: VD11.A C27.- 105.64,58.08 C28.2
  other vias: 41.82,15.73 41.82,18.27 38.65,16.99 38.65,15.73 38.65,18.27 41.82,16.99 35.63,15.73 35.63,18.27 35.63,16.99
  pour Bottom (isolate 0.406, no thermals): 34.84,25.09 34.84,9.53 36.42,7.95 42.46,7.95 42.46,9.22 42.3,25.09
  pour Top (isolate 0.406, no thermals): 35,9.22 42.46,9.22 42.46,25.09 35,25.09
VDD  (via drill 0.5)
  Top 0.305: v99.29,48.74 99.92,48.11 v99.92,45.09
  Top 0.4: C25.+ 127.39,56.68 123.9,53.19 122.63,53.19 VDD.1
  Bottom 0.3: 119.61,49.38 119.61,51.28 113.58,51.28 111.2,53.67 107.23,53.67 104.05,50.49 103.42,50.49 101.67,48.74 v99.29,48.74
  Bottom 0.305: v99.92,45.09 99.71,45.31 C19.2 98.97,46.36 97.98,47.35 U2.5
  Bottom 0.4: C25.+ 129.26,54.9 C26.1 | R40.1 VD13.A 119.61,49.38 119.45,49.38 119.61,49.54 119.61,51.28 119.61,52.9 VD10.C 121.99,53.19 VDD.1
VDDANA  (via drill 0.5)
  Top 0.3: v90.08,13.5 90.08,15.73 v91.19,16.84
  Bottom 0.2: U10.6 90.81,12.78 v90.08,13.5
  Bottom 0.3: C50.1 v91.19,16.84 91.19,19.38 C49.+
  Bottom 0.305: FB1.2 92.3,19.88 C49.+
VDDCORE
  Bottom 0.2: U10.43 96.18,5.53 C54.2
VDDUSB
  Bottom 0.254: X4.VBUS 146.54,14.14 147.87,14.14 148.5,13.5 148.5,7.47 146.92,5.88 C35.1 146.81,5.36 146.5,5.68 146.48,5.68 146.28,5.68 U6.8 U6.7
  Bottom 0.4: VD17.A 141.23,15.85 144.22,12.87 145.23,12.87 X4.VBUS
VDDX6  (via drill 0.5)
  Top 0.305: X6.1 103.77,12.42 104.69,13.34 104.69,17.95 v104.53,18.11
  Bottom 0.2: 128.47,24.46 VD25.A
  Bottom 0.305: v104.53,18.11 104.53,20.65 107.39,23.5 111.2,23.5 112.31,22.39 118.02,22.39 118.97,23.34 122.15,23.34 122.94,22.55 128.02,22.55 128.5,23.03 VD25.A

## Text on the board
Bottom: D21.v38
tPlace: + | Designed by Olmoro | + | + | + | + | - | + | + | +
tNames: -